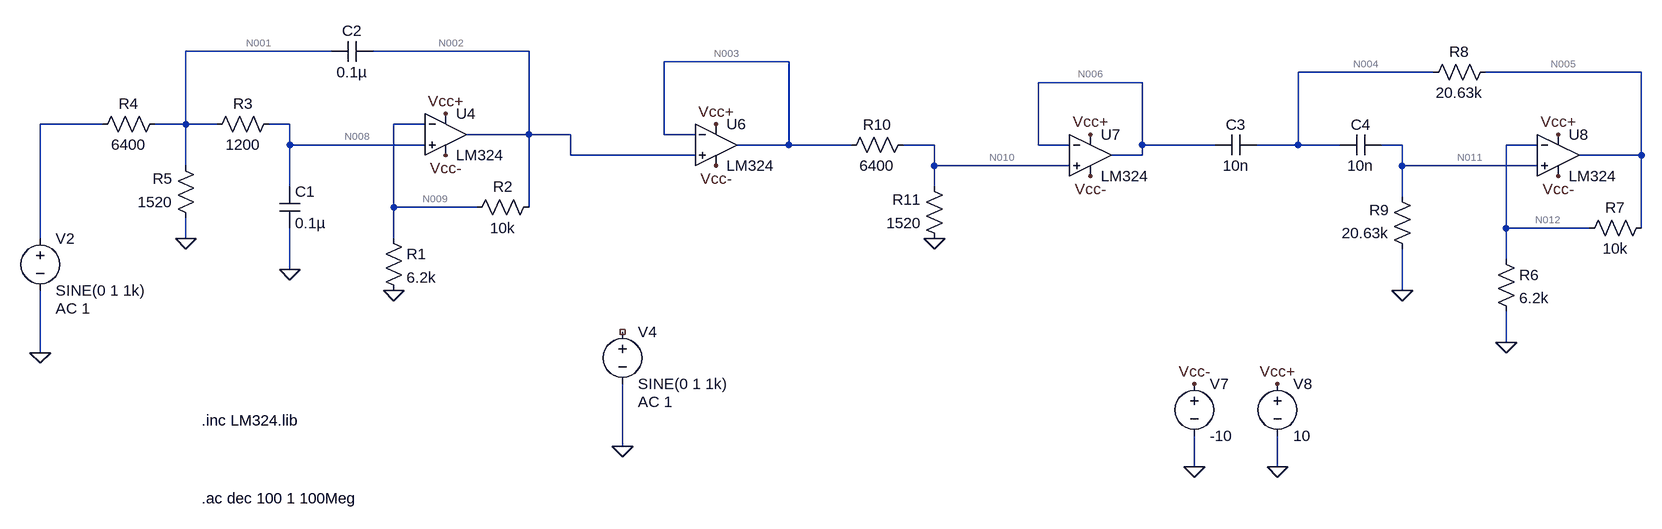
[diagram p0: schematic Lab4_simPasaBanda.asc]
Lab4_simPasaBanda.asc, the LTspice schematic file:
Version 4.1
SHEET 1 2244 768
WIRE -32 64 -256 64
WIRE 272 64 32 64
WIRE 672 80 480 80
WIRE 1664 96 1456 96
WIRE 1984 96 1744 96
WIRE 1216 112 1056 112
WIRE -384 176 -480 176
WIRE -256 176 -256 64
WIRE -256 176 -304 176
WIRE -208 176 -256 176
WIRE -96 176 -128 176
WIRE 112 176 64 176
WIRE 272 192 272 64
WIRE 272 192 176 192
WIRE 336 192 272 192
WIRE 480 192 480 80
WIRE 528 192 480 192
WIRE -96 208 -96 176
WIRE 112 208 -96 208
WIRE 672 208 672 80
WIRE 672 208 592 208
WIRE 768 208 672 208
WIRE 896 208 848 208
WIRE 1056 208 1056 112
WIRE 1104 208 1056 208
WIRE 1216 208 1216 112
WIRE 1328 208 1216 208
WIRE 1456 208 1456 96
WIRE 1456 208 1392 208
WIRE 1520 208 1456 208
WIRE 1616 208 1584 208
WIRE 1824 208 1776 208
WIRE 336 224 336 192
WIRE 528 224 336 224
WIRE 1216 224 1216 208
WIRE 1216 224 1168 224
WIRE 1984 224 1984 96
WIRE 1984 224 1888 224
WIRE -256 240 -256 176
WIRE 896 240 896 208
WIRE 1104 240 896 240
WIRE 1616 240 1616 208
WIRE 1824 240 1616 240
WIRE -96 272 -96 208
WIRE 896 272 896 240
WIRE 1616 288 1616 240
WIRE 64 304 64 176
WIRE 192 304 64 304
WIRE 272 304 272 192
WIRE 1776 336 1776 208
WIRE 1904 336 1776 336
WIRE 1984 336 1984 224
WIRE -480 352 -480 176
WIRE -256 352 -256 320
WIRE 64 352 64 304
WIRE 1776 384 1776 336
WIRE -96 400 -96 336
WIRE 1616 432 1616 368
WIRE 1776 512 1776 464
WIRE -480 528 -480 432
WIRE 416 672 416 576
WIRE 1296 704 1296 656
WIRE 1424 704 1424 656
FLAG 64 432 0
FLAG -480 528 0
FLAG 144 224 Vcc-
FLAG 144 160 Vcc+
FLAG -96 400 0
FLAG -256 352 0
FLAG 1776 512 0
FLAG 416 672 0
FLAG 1856 256 Vcc-
FLAG 1856 192 Vcc+
FLAG 1616 432 0
FLAG 1136 192 Vcc+
FLAG 1136 256 Vcc-
FLAG 896 352 0
FLAG 560 176 Vcc+
FLAG 560 240 Vcc-
FLAG 1296 704 0
FLAG 1424 704 0
FLAG 1296 576 Vcc-
FLAG 1424 576 Vcc+
SYMBOL res 48 336 R0
SYMATTR InstName R1
SYMATTR Value 6.2k
SYMBOL res 288 288 R90
WINDOW 0 0 56 VBottom 2
WINDOW 3 32 56 VTop 2
SYMATTR InstName R2
SYMATTR Value 10k
SYMBOL voltage -480 336 R0
WINDOW 123 24 124 Left 2
WINDOW 39 0 0 Left 0
SYMATTR Value2 AC 1
SYMATTR InstName V2
SYMATTR Value SINE(0 1 1k)
SYMBOL cap -112 272 R0
SYMATTR InstName C1
SYMATTR Value 0.1µ
SYMBOL res -112 160 R90
WINDOW 0 0 56 VBottom 2
WINDOW 3 32 56 VTop 2
SYMATTR InstName R3
SYMATTR Value 1200
SYMBOL res -288 160 R90
WINDOW 0 0 56 VBottom 2
WINDOW 3 32 56 VTop 2
SYMATTR InstName R4
SYMATTR Value 6400
SYMBOL cap 32 48 R90
WINDOW 0 0 32 VBottom 2
WINDOW 3 32 32 VTop 2
SYMATTR InstName C2
SYMATTR Value 0.1µ
SYMBOL res -240 336 R180
WINDOW 0 36 76 Left 2
WINDOW 3 36 40 Left 2
SYMATTR InstName R5
SYMATTR Value 1520
SYMBOL res 1760 368 R0
SYMATTR InstName R6
SYMATTR Value 6.2k
SYMBOL res 2000 320 R90
WINDOW 0 0 56 VBottom 2
WINDOW 3 32 56 VTop 2
SYMATTR InstName R7
SYMATTR Value 10k
SYMBOL voltage 416 480 R0
WINDOW 123 24 124 Left 2
WINDOW 39 0 0 Left 0
SYMATTR Value2 AC 1
SYMATTR InstName V4
SYMATTR Value SINE(0 1 1k)
SYMBOL res 1760 80 R90
WINDOW 0 0 56 VBottom 2
WINDOW 3 32 56 VTop 2
SYMATTR InstName R8
SYMATTR Value 20.63k
SYMBOL res 1632 384 R180
WINDOW 0 36 76 Left 2
WINDOW 3 36 40 Left 2
SYMATTR InstName R9
SYMATTR Value 20.63k
SYMBOL cap 1392 192 R90
WINDOW 0 0 32 VBottom 2
WINDOW 3 32 32 VTop 2
SYMATTR InstName C3
SYMATTR Value 10n
SYMBOL cap 1584 192 R90
WINDOW 0 0 32 VBottom 2
WINDOW 3 32 32 VTop 2
SYMATTR InstName C4
SYMATTR Value 10n
SYMBOL res 864 192 R90
WINDOW 0 0 56 VBottom 2
WINDOW 3 32 56 VTop 2
SYMATTR InstName R10
SYMATTR Value 6400
SYMBOL res 912 368 R180
WINDOW 0 36 76 Left 2
WINDOW 3 36 40 Left 2
SYMATTR InstName R11
SYMATTR Value 1520
SYMBOL OpAmps\\opamp2 144 128 R0
SYMATTR InstName U4
SYMATTR Value LM324
SYMBOL OpAmps\\opamp2 560 144 R0
SYMATTR InstName U6
SYMATTR Value LM324
SYMBOL OpAmps\\opamp2 1136 160 R0
SYMATTR InstName U7
SYMATTR Value LM324
SYMBOL OpAmps\\opamp2 1856 160 R0
SYMATTR InstName U8
SYMATTR Value LM324
SYMBOL voltage 1296 560 R0
WINDOW 123 0 0 Left 0
WINDOW 39 0 0 Left 0
SYMATTR InstName V7
SYMATTR Value -10
SYMBOL voltage 1424 560 R0
WINDOW 123 0 0 Left 0
WINDOW 39 0 0 Left 0
SYMATTR InstName V8
SYMATTR Value 10
TEXT -232 632 Left 2 !.inc LM324.lib
TEXT -232 752 Left 2 !.ac dec 100 1 100Meg

The netlist it stands for:
* Lab4_simPasaBanda.asc
R1 N009 0 6.2k
R2 N002 N009 10k
V2 N007 0 SINE(0 1 1k) AC 1
C1 N008 0 0.1µ
R3 N008 N001 1200
R4 N001 N007 6400
C2 N002 N001 0.1µ
R5 0 N001 1520
R6 N012 0 6.2k
R7 N005 N012 10k
V4 NC_01 0 SINE(0 1 1k) AC 1
R8 N005 N004 20.63k
R9 0 N011 20.63k
C3 N004 N006 10n
C4 N011 N004 10n
R10 N010 N003 6400
R11 0 N010 1520
X§U4 N008 N009 Vcc+ Vcc- N002 LM324  ; pins In+ In- V+ V- OUT
X§U6 N002 N003 Vcc+ Vcc- N003 LM324  ; pins In+ In- V+ V- OUT
X§U7 N010 N006 Vcc+ Vcc- N006 LM324  ; pins In+ In- V+ V- OUT
X§U8 N011 N012 Vcc+ Vcc- N005 LM324  ; pins In+ In- V+ V- OUT
V7 Vcc- 0 -10
V8 Vcc+ 0 10
.inc LM324.lib
.ac dec 100 1 100Meg
.backanno
.end

* Results of the author's LTspice run, read from the files saved beside the schematic
* Operating Point, zero values left out:
*   V(n001) = 24.47 µV
*   V(n002) = -160.9 µV
*   V(n003) = -194.6 µV
*   V(n004) = 786.5 µV
*   V(n005) = 786.5 µV
*   V(n006) = -46.53 µV
*   V(n008) = 48.38 µV
*   V(n009) = 14.72 µV
*   V(n010) = -12.87 µV
*   V(n011) = 411 µV
*   V(n012) = 377.3 µV
*   V(vcc+) = 10 V
*   V(vcc-) = -10 V
*   I(R1) = 2.374 nA
*   I(R10) = 28.39 nA
*   I(R11) = 8.468 nA
*   I(R2) = -17.57 nA
*   I(R3) = 19.92 nA
*   I(R4) = 3.824 nA
*   I(R5) = -16.1 nA
*   I(R6) = 60.86 nA
*   I(R7) = 40.92 nA
*   I(R9) = -19.92 nA
*   I(V2) = 3.824 nA
*   I(V7) = 2.679 mA
*   I(V8) = -2.68 mA
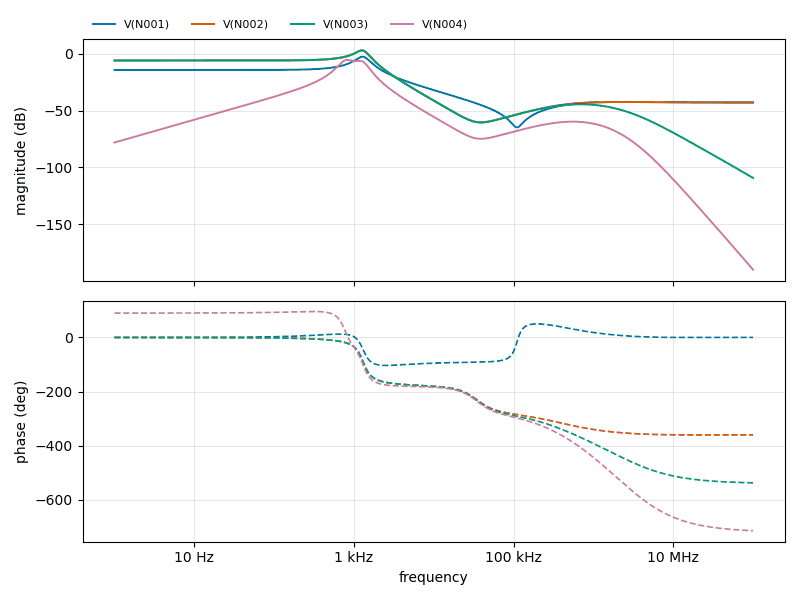
[diagram p1: AC Analysis of Lab4_simPasaBanda.asc, plotted from the saved traces]
* AC Analysis, 1 run:
*   V(N001): -14.34 dB at 1 Hz, -42.85 dB at 100 MHz, peak -2.65 dB at 1.288 kHz, 3 dB below the peak at 1.04 kHz and 1.523 kHz
*   V(N002): -6.00 dB at 1 Hz, -42.85 dB at 100 MHz, peak 2.87 dB at 1.259 kHz, 3 dB below the peak at 987.1 Hz and 1.484 kHz
*   V(N003): -6.00 dB at 1 Hz, -109.17 dB at 100 MHz, peak 2.87 dB at 1.259 kHz, 3 dB below the peak at 987.1 Hz and 1.484 kHz
*   V(N004): -78.08 dB at 1 Hz, -189.82 dB at 100 MHz, peak -5.49 dB at 812.8 Hz, 3 dB below the peak at 683.1 Hz and 1.379 kHz